# Altium schematic sheet LED drivers.SchDoc
size A4; SheetNumber: 3; SheetTotal: 3
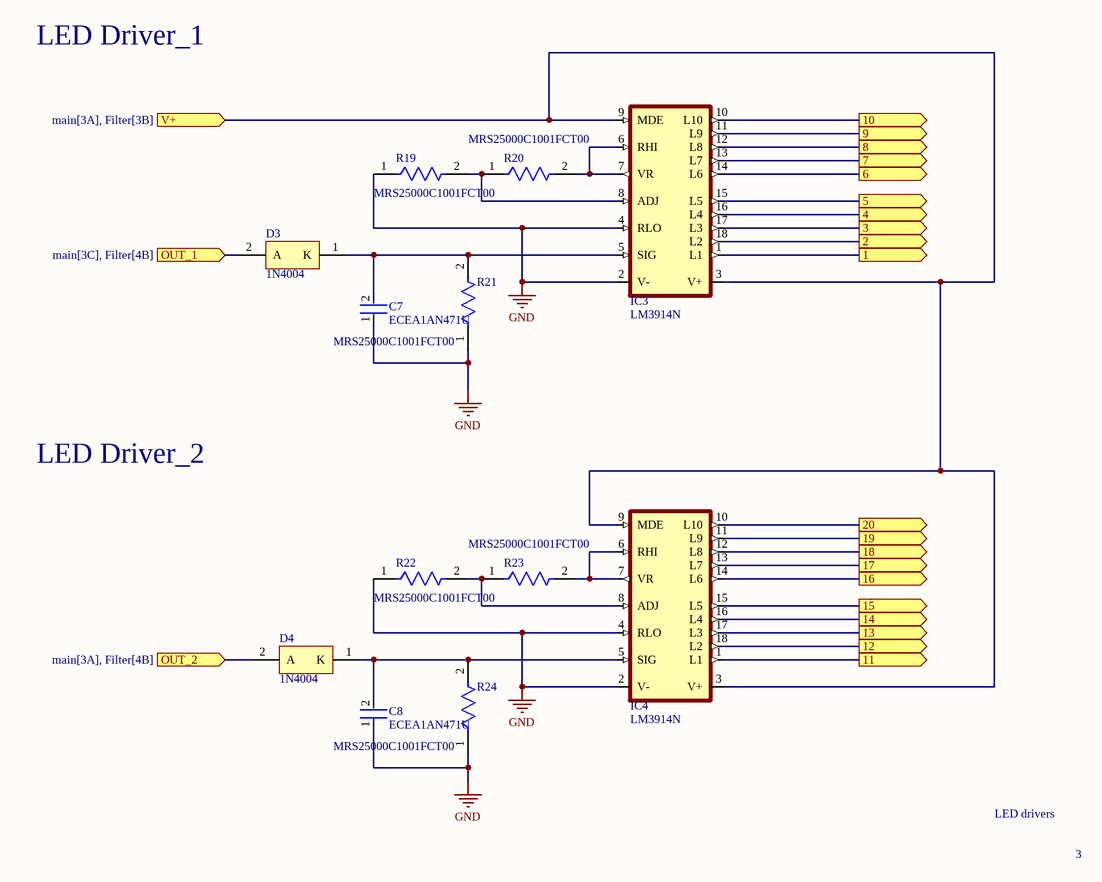
[diagram p0: LED drivers.SchDoc]

## Parts
C7  ECEA1AN471U  [FP-RAD-TH-D_10_0_5-L_16_1-MFG]
C8  ECEA1AN471U  [FP-RAD-TH-D_10_0_5-L_16_1-MFG]
D3  1N4004  [ONSC-AXIAL_LEAD-2-59-10_P]
D4  1N4004  [ONSC-AXIAL_LEAD-2-59-10_P]
IC3  LM3914N  [DIL18]
IC4  LM3914N  [DIL18]
R19  MRS25000C1001FCT00  [FP-MRS25-MFG]
R20  MRS25000C1001FCT00  [FP-MRS25-MFG]
R21  MRS25000C1001FCT00  [FP-MRS25-MFG]
R22  MRS25000C1001FCT00  [FP-MRS25-MFG]
R23  MRS25000C1001FCT00  [FP-MRS25-MFG]
R24  MRS25000C1001FCT00  [FP-MRS25-MFG]

## Ports
1 (out, see main[3B]), 2 (out, see main[3B]), 3 (out, see main[3B]), 4 (out, see main[3B]), 5 (out, see main[3B]), 6 (out, see main[3B]), 7 (out, see main[3B]), 8 (out, see main[3B]), 9 (out, see main[3C]), 10 (out, see main[3C]), 11 (out, see main[3A]), 12 (out, see main[3A]), 13 (out, see main[3B]), 14 (out, see main[3B]), 15 (out, see main[3B]), 16 (out, see main[3B]), 17 (out, see main[3B]), 18 (out, see main[3B]), 19 (out, see main[3B]), 20 (out, see main[3B]), OUT_1 (in, see main[3C], Filter[4B]), OUT_2 (in, see main[3A], Filter[4B]), V+ (in, see main[3A], Filter[3B])

## Nets
GND: C7.1 C8.1 IC3.2(V-) IC3.4(RLO) IC4.2(V-) IC4.4(RLO) R19.1 R21.1 R22.1 R24.1
1: IC3.1(L1) ; port 1
2: IC3.18(L2) ; port 2
3: IC3.17(L3) ; port 3
4: IC3.16(L4) ; port 4
5: IC3.15(L5) ; port 5
6: IC3.14(L6) ; port 6
7: IC3.13(L7) ; port 7
8: IC3.12(L8) ; port 8
9: IC3.11(L9) ; port 9
10: IC3.10(L10) ; port 10
11: IC4.1(L1) ; port 11
12: IC4.18(L2) ; port 12
13: IC4.17(L3) ; port 13
14: IC4.16(L4) ; port 14
15: IC4.15(L5) ; port 15
16: IC4.14(L6) ; port 16
17: IC4.13(L7) ; port 17
18: IC4.12(L8) ; port 18
19: IC4.11(L9) ; port 19
20: IC4.10(L10) ; port 20
OUT_1: D3.2(A) ; port OUT_1
OUT_2: D4.2(A) ; port OUT_2
V+: IC3.3(V+) IC3.9(MDE) IC4.3(V+) IC4.9(MDE) ; port V+
NetC7_2: C7.2 D3.1(K) IC3.5(SIG) R21.2
NetC8_2: C8.2 D4.1(K) IC4.5(SIG) R24.2
NetIC3_6: IC3.6(RHI) IC3.7(VR) R20.2
NetIC3_8: IC3.8(ADJ) R19.2 R20.1
NetIC4_6: IC4.6(RHI) IC4.7(VR) R23.2
NetIC4_8: IC4.8(ADJ) R22.2 R23.1

## Notes on the sheet
- LED Driver_1
- LED Driver_2
- LED drivers
- 3

## Library data of the parts
C7 C8 = CMP-05427-001928-1: Aluminum Electrolytic Capacitors (Radial Lead Type) 470uF ±20% 10V; Lead Diameter: 0.6mm; Dissipation Factor: 0.25%; Life (Hours): 2000Hour; Leakage Current: 3uA; Ripple Current: 340mA; Mount: Through Hole; REACH SVHC: No SVHC; Height: 16mm; Max Operating Temperature: 85°C; Case/Package: Radial; Packaging: Bulk; RoHS Compliant: Yes; Min Operating Temperature: -40°C; Termination: Radial; Height - Seated (Max): 0.63inch; Series: SU; Construction: RADIAL; Capacitance: 470uF; Tolerance: 20%; Radiation Hardening: No; Voltage Rating (DC): 10V; Lead Free: Lead Free; Diameter: 10mm; Lead Pitch: 5mm; Voltage Rating: 10V; Length: 16mm; Voltage: 10V; Package Quantity: 200
D3 D4 = CMP-0902-00115-1: Standard Recovery Rectifier, 2-Pin Axial_Lead, Pb-Free, Bulk Bag; Manufacturer: On Semiconductor; IFSM Max (A): 30; IO(rec) Max (A): 1; VRRM Max (V): 400; Type: Standard Recovery; Packing: Bulk Bag; PackageVersion: Rev. U, 02/2005; ComponentLink1URL: http://www.onsemi.com/; ComponentLink3URL: http://www.onsemi.cn/pub_link/Collateral/59-10.PDF; DatasheetVersion: Rev. 13; PartNumber: 1N4004; ComponentLink1Description: Manufacturer URL; Mounting Technology: Through Hole; PackageReference: AXIAL_LEAD-2-59-10; ComponentLink3Description: Package Specification; ComponentLink2URL: http://www.onsemi.com/pub_link/Collateral/1N4001-D.PDF; ComponentLink2Description: Datasheet; PackageDescription: 2-Pin, Axial Lead, Diameter 2.35 mm; RoHS: TRUE
IC3 IC4 = LM3914N: LED Lighting Drivers; MF: Texas Instruments; MP: LM3914N; Package: None; Price: None; Availability: Unavailable; Value: *; SnapEDA_Link: https://www.snapeda.com/parts/LM3914N/Texas%20Instruments/view-part/4652973/?ref=snap
R19-R24 = CMP-02408-000051-1: RES 1K OHM 0.6W 1% AXIAL; Power Rating: 600mW; Lead Diameter: 0.6mm; Voltage Rating (DC): 350V; Resistance: 1kR; Temperature Coefficient: 50ppm/°C; Width: 2.5mm; Military Standard: Not; Package Quantity: 5000; Radiation Hardening: No; Case/Package: Axial; Resistance Tolerance: 1%; Resistor Type: Metal Film; Contact Plating: Tin; Length: 6.5mm; Lead Free: Lead Free; RoHS Compliant: Yes; Mount: Through Hole; Number of Pins: 2; Technology: THIN FILM; Voltage Rating: 350V; Min Operating Temperature: -55°C; Weight: 0.00776oz; Diameter: 2.5mm; Construction: Cylindrical; Series: MRS25; Tolerance: 1%; Packaging: Tape and Reel; Max Operating Temperature: 155°C; Max Power Dissipation: 600mW; Number of Terminations: 2; Termination: Axial